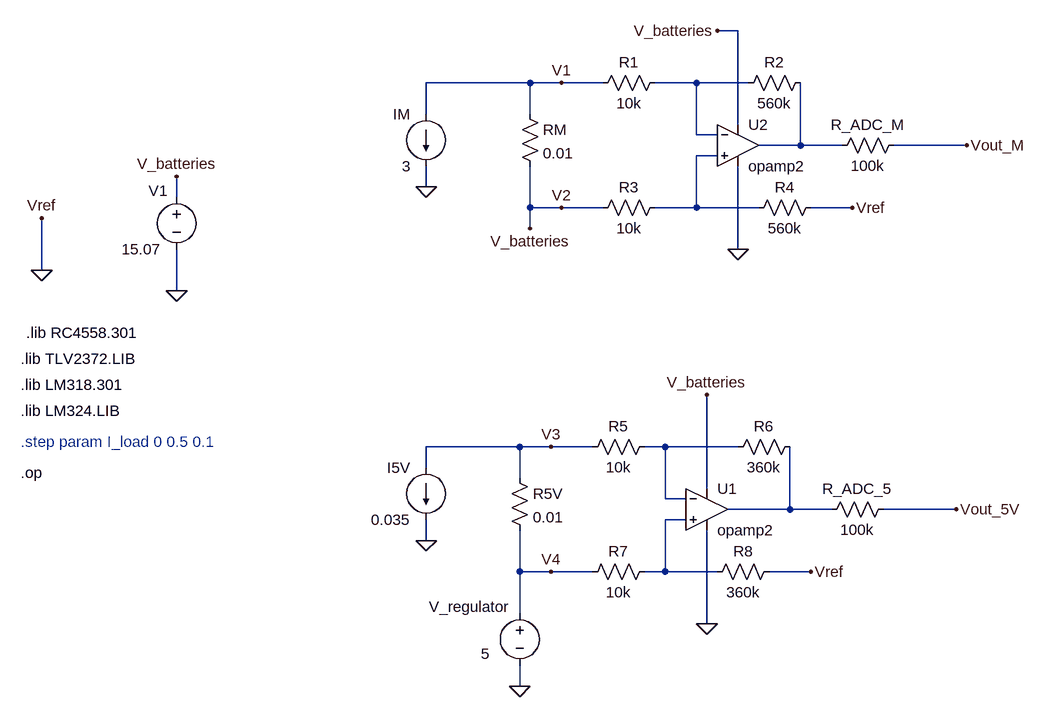
[diagram p0: schematic current_sense_interface.asc]
current_sense_interface.asc, the LTspice schematic file:
Version 4
SHEET 1 1348 1032
WIRE 240 -16 208 -16
WIRE -80 64 -240 64
WIRE -32 64 -80 64
WIRE 32 64 -32 64
WIRE 176 64 112 64
WIRE 256 64 176 64
WIRE -240 112 -240 64
WIRE -80 112 -80 64
WIRE 240 128 240 -16
WIRE 176 144 176 64
WIRE 208 144 176 144
WIRE 336 160 336 64
WIRE 336 160 272 160
WIRE 400 160 336 160
WIRE 592 160 480 160
WIRE 208 176 176 176
WIRE -240 224 -240 192
WIRE -624 240 -624 208
WIRE -80 256 -80 192
WIRE -32 256 -80 256
WIRE 32 256 -32 256
WIRE 176 256 176 176
WIRE 176 256 112 256
WIRE 272 256 176 256
WIRE 416 256 352 256
WIRE -80 288 -80 256
WIRE 240 320 240 192
WIRE -832 352 -832 272
WIRE -624 384 -624 320
WIRE -96 624 -240 624
WIRE -48 624 -96 624
WIRE 16 624 -48 624
WIRE 128 624 96 624
WIRE 240 624 128 624
WIRE -240 656 -240 624
WIRE -96 672 -96 624
WIRE 192 688 192 544
WIRE 128 704 128 624
WIRE 160 704 128 704
WIRE 320 720 320 624
WIRE 320 720 224 720
WIRE 384 720 320 720
WIRE 576 720 464 720
WIRE 160 736 128 736
WIRE -240 768 -240 736
WIRE -96 816 -96 752
WIRE -48 816 -96 816
WIRE 16 816 -48 816
WIRE 128 816 128 736
WIRE 128 816 96 816
WIRE 208 816 128 816
WIRE 352 816 288 816
WIRE -96 880 -96 816
WIRE 192 896 192 752
WIRE -96 992 -96 960
FLAG -240 224 0
FLAG -624 384 0
FLAG 592 160 Vout_M
FLAG 416 256 Vref
FLAG -32 256 V2
FLAG -32 64 V1
FLAG 208 -16 V_batteries
FLAG -96 992 0
FLAG 576 720 Vout_5V
FLAG 352 816 Vref
FLAG -48 816 V4
FLAG -48 624 V3
FLAG 192 544 V_batteries
FLAG 192 896 0
FLAG -240 768 0
FLAG -832 272 Vref
FLAG -832 352 0
FLAG 240 320 0
FLAG -624 208 V_batteries
FLAG -80 288 V_batteries
DATAFLAG 176 64 ""
DATAFLAG 176 256 ""
DATAFLAG -64 256 ""
DATAFLAG -80 80 ""
DATAFLAG 528 720 ""
DATAFLAG 528 160 ""
DATAFLAG -32 608 ""
SYMBOL res 352 48 R90
WINDOW 0 0 56 VBottom 2
WINDOW 3 32 56 VTop 2
SYMATTR InstName R2
SYMATTR Value 560k
SYMATTR SpiceLine tol=1 pwr=0.6
SYMBOL res 368 240 R90
WINDOW 0 0 56 VBottom 2
WINDOW 3 32 56 VTop 2
SYMATTR InstName R4
SYMATTR Value 560k
SYMATTR SpiceLine tol=1 pwr=0.6
SYMBOL res 128 240 R90
WINDOW 0 0 56 VBottom 2
WINDOW 3 32 56 VTop 2
SYMATTR InstName R3
SYMATTR Value 10k
SYMATTR SpiceLine tol=1 pwr=0.6
SYMBOL res 128 48 R90
WINDOW 0 0 56 VBottom 2
WINDOW 3 32 56 VTop 2
SYMATTR InstName R1
SYMATTR Value 10k
SYMATTR SpiceLine tol=1 pwr=0.6
SYMBOL res 496 144 R90
WINDOW 0 0 56 VBottom 2
WINDOW 3 32 56 VTop 2
SYMATTR InstName R_ADC_M
SYMATTR Value 100k
SYMATTR SpiceLine tol=1 pwr=0.6
SYMBOL voltage -624 224 R0
WINDOW 0 -14 6 Right 2
WINDOW 3 -85 96 Left 2
WINDOW 123 0 0 Left 0
WINDOW 39 0 0 Left 0
SYMATTR InstName V1
SYMATTR Value 15.07
SYMBOL res -96 96 R0
SYMATTR InstName RM
SYMATTR Value 0.01
SYMATTR SpiceLine tol=1 pwr=1
SYMBOL current -240 112 M0
WINDOW 123 24 108 Left 2
WINDOW 39 0 0 Left 0
SYMATTR InstName IM
SYMATTR Value 3
SYMBOL res 336 608 R90
WINDOW 0 0 56 VBottom 2
WINDOW 3 32 56 VTop 2
SYMATTR InstName R6
SYMATTR Value 360k
SYMATTR SpiceLine tol=1 pwr=0.6
SYMBOL res 304 800 R90
WINDOW 0 0 56 VBottom 2
WINDOW 3 32 56 VTop 2
SYMATTR InstName R8
SYMATTR Value 360k
SYMATTR SpiceLine tol=1 pwr=0.6
SYMBOL res 112 800 R90
WINDOW 0 0 56 VBottom 2
WINDOW 3 32 56 VTop 2
SYMATTR InstName R7
SYMATTR Value 10k
SYMATTR SpiceLine tol=1 pwr=0.6
SYMBOL res 112 608 R90
WINDOW 0 0 56 VBottom 2
WINDOW 3 32 56 VTop 2
SYMATTR InstName R5
SYMATTR Value 10k
SYMATTR SpiceLine tol=1 pwr=0.6
SYMBOL res 480 704 R90
WINDOW 0 0 56 VBottom 2
WINDOW 3 32 56 VTop 2
SYMATTR InstName R_ADC_5
SYMATTR Value 100k
SYMATTR SpiceLine tol=1 pwr=0.6
SYMBOL voltage -96 864 R0
WINDOW 0 -14 6 Right 2
WINDOW 3 -60 78 Left 2
WINDOW 123 0 0 Left 0
WINDOW 39 0 0 Left 0
SYMATTR InstName V_regulator
SYMATTR Value 5
SYMBOL res -112 656 R0
SYMATTR InstName R5V
SYMATTR Value 0.01
SYMATTR SpiceLine tol=1 pwr=1
SYMBOL current -240 656 M0
WINDOW 123 24 108 Left 2
WINDOW 39 0 0 Left 0
SYMATTR InstName I5V
SYMATTR Value 0.035
SYMBOL OpAmps\\opamp2 192 656 R0
SYMATTR InstName U1
SYMATTR Value2 LM324
SYMBOL OpAmps\\opamp2 240 96 R0
SYMATTR InstName U2
SYMATTR Value2 LM324
TEXT -864 616 Left 2 ;.step param I_load 0 0.5 0.1
TEXT -864 488 Left 2 !.lib TLV2372.LIB
TEXT -856 448 Left 2 !.lib RC4558.301
TEXT -864 528 Left 2 !.lib LM318.301
TEXT -864 568 Left 2 !.lib LM324.LIB
TEXT -864 664 Left 2 !.op

The netlist it stands for:
* current_sense_interface.asc
R2 N002 N001 560k tol=1 pwr=0.6
R4 0 N003 560k tol=1 pwr=0.6
R3 N003 V_batteries 10k tol=1 pwr=0.6
R1 N001 V1 10k tol=1 pwr=0.6
R_ADC_M Vout_M N002 100k tol=1 pwr=0.6
V1 V_batteries 0 15.07
RM V1 V_batteries 0.01 tol=1 pwr=1
IM V1 0 3
R6 N005 N004 360k tol=1 pwr=0.6
R8 0 N006 360k tol=1 pwr=0.6
R7 N006 V4 10k tol=1 pwr=0.6
R5 N004 V3 10k tol=1 pwr=0.6
R_ADC_5 Vout_5V N005 100k tol=1 pwr=0.6
V_regulator V4 0 5
R5V V3 V4 0.01 tol=1 pwr=1
I5V V3 0 0.035
XU1 N006 N004 V_batteries 0 N005 opamp2 LM324  ; pins In+ In- V+ V- OUT
XU2 N003 N001 V_batteries 0 N002 opamp2 LM324  ; pins In+ In- V+ V- OUT
* .step param I_load 0 0.5 0.1
.lib TLV2372.LIB
.lib RC4558.301
.lib LM318.301
.lib LM324.LIB
.op
.backanno
.end